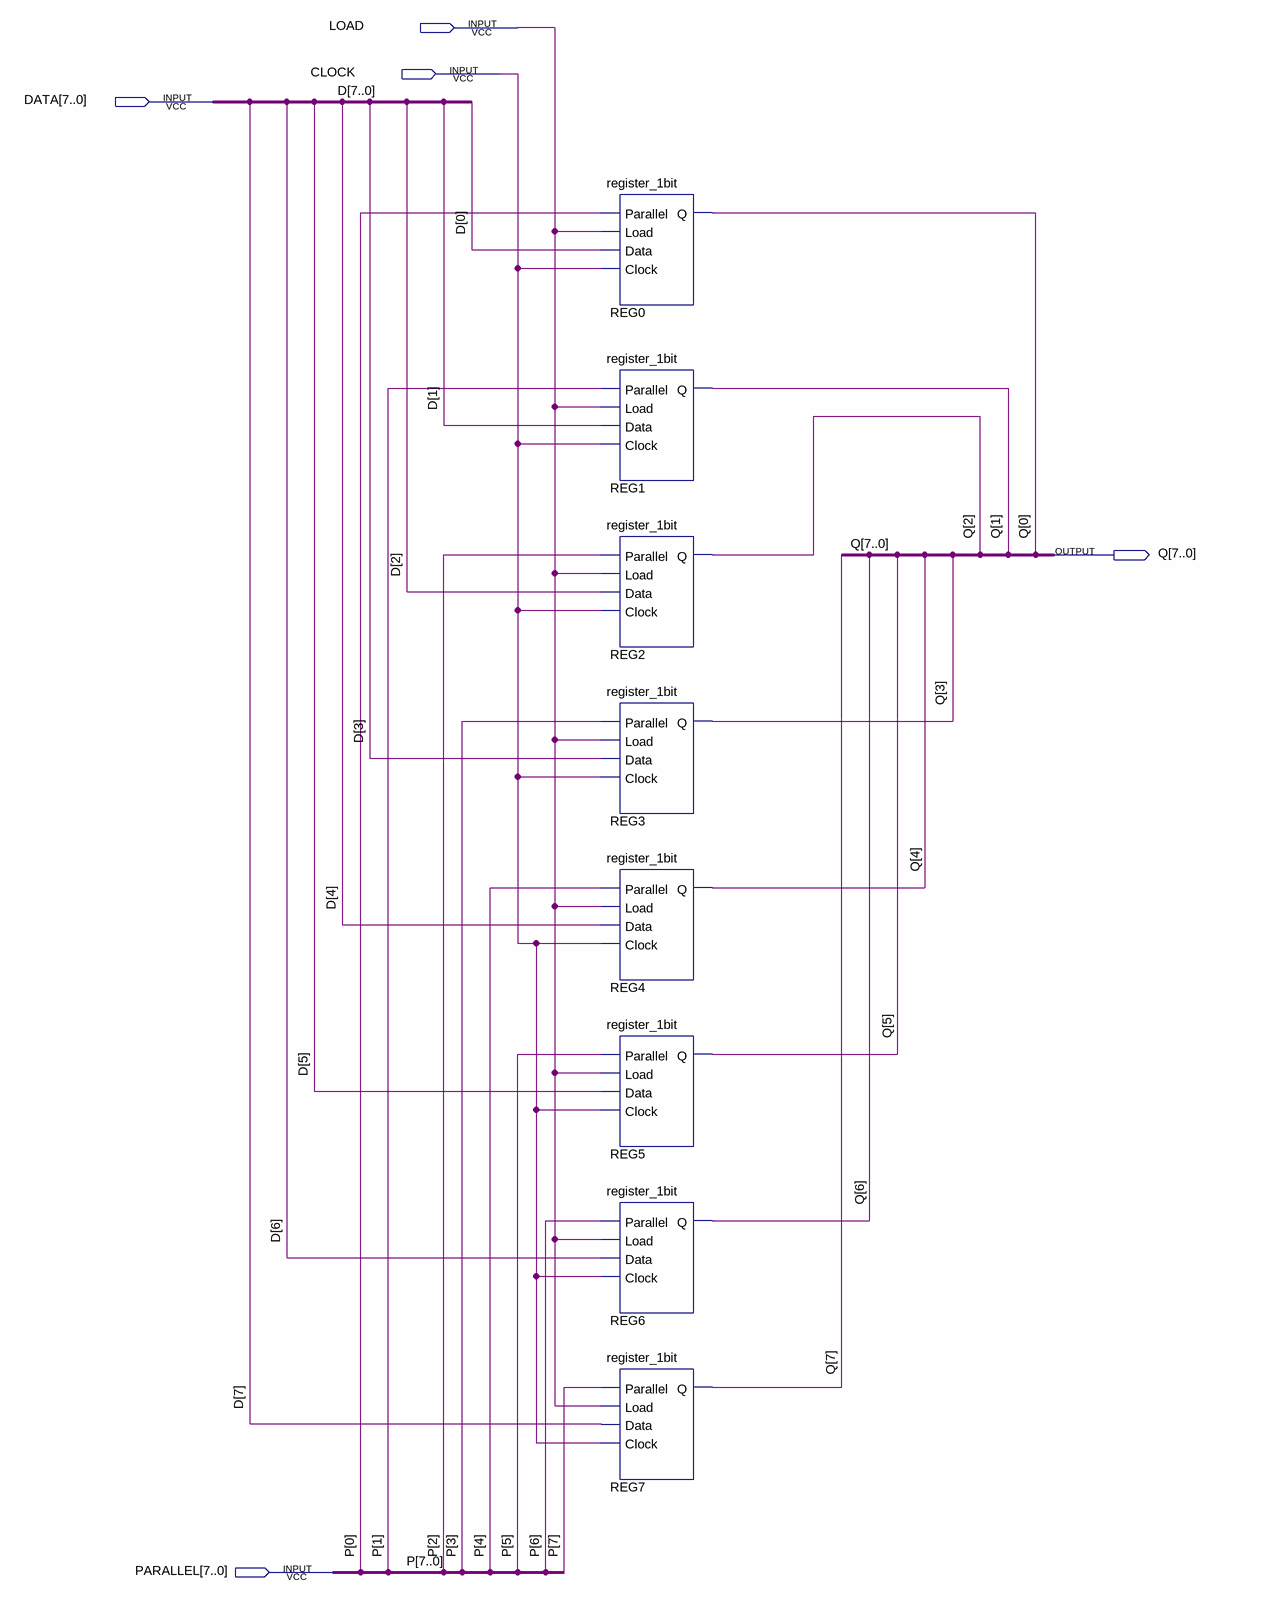
[diagram p0: schematic sheet]
// Quartus schematic register_8bits.bdf as structural Verilog: 8 symbols, 5 pins
module register_8bits (
  input  LOAD,
  input  CLOCK,
  input  [7:0] DATA,
  input  [7:0] PARALLEL,
  output [7:0] Q
);

  register_1bit REG0 (.Parallel(PARALLEL[0]), .Load(LOAD), .Data(DATA[0]), .Clock(CLOCK), .Q(Q[0]));
  register_1bit REG1 (.Parallel(PARALLEL[1]), .Load(LOAD), .Data(DATA[1]), .Clock(CLOCK), .Q(Q[1]));
  register_1bit REG2 (.Parallel(PARALLEL[2]), .Load(LOAD), .Data(DATA[2]), .Clock(CLOCK), .Q(Q[2]));
  register_1bit REG3 (.Parallel(PARALLEL[3]), .Load(LOAD), .Data(DATA[3]), .Clock(CLOCK), .Q(Q[3]));
  register_1bit REG4 (.Parallel(PARALLEL[4]), .Load(LOAD), .Data(DATA[4]), .Clock(CLOCK), .Q(Q[4]));
  register_1bit REG5 (.Parallel(PARALLEL[5]), .Load(LOAD), .Data(DATA[5]), .Clock(CLOCK), .Q(Q[5]));
  register_1bit REG6 (.Parallel(PARALLEL[6]), .Load(LOAD), .Data(DATA[6]), .Clock(CLOCK), .Q(Q[6]));
  register_1bit REG7 (.Parallel(PARALLEL[7]), .Load(LOAD), .Data(DATA[7]), .Clock(CLOCK), .Q(Q[7]));

  // Other names for the same wires on the sheet: D[7:0] = DATA; P[7:0] = PARALLEL
endmodule
